# Altium schematic sheet Screen.SchDoc: =ProjectName
size A4; CheckedBy: DatNB; Author: Ven; CompanyName: Nacentech; Organization: IMET
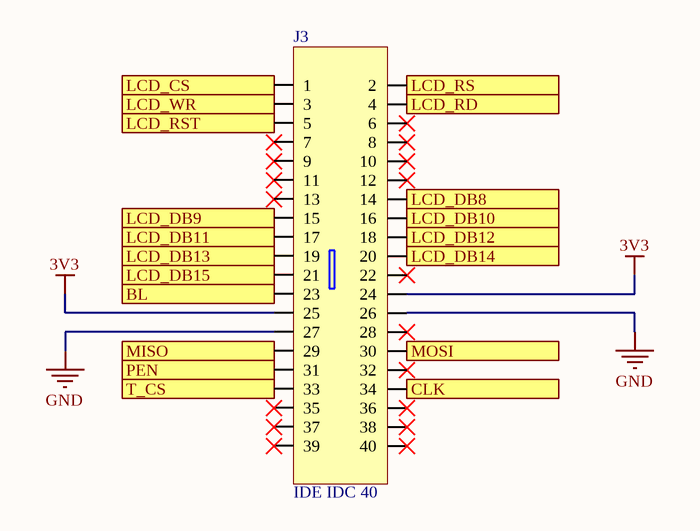
[diagram p0: Screen.SchDoc]

## Parts
J3  IDE IDC 40  [IDE 20X2]

## Ports
BL (in), CLK (in), LCD_CS (in), LCD_DB8 (in), LCD_DB9 (in), LCD_DB10 (in), LCD_DB11 (in), LCD_DB12 (in), LCD_DB13 (in), LCD_DB14 (in), LCD_DB15 (in), LCD_RD (in), LCD_RS (in), LCD_RST (in), LCD_WR (in), MISO (out), MOSI (in), PEN (out), T_CS (in)

## Nets
3V3: J3.24 J3.25
GND: J3.26 J3.27
BL: J3.23 ; port BL
CLK: J3.34 ; port CLK
LCD_CS: J3.1 ; port LCD_CS
LCD_DB8: J3.14 ; port LCD_DB8
LCD_DB9: J3.15 ; port LCD_DB9
LCD_DB10: J3.16 ; port LCD_DB10
LCD_DB11: J3.17 ; port LCD_DB11
LCD_DB12: J3.18 ; port LCD_DB12
LCD_DB13: J3.19 ; port LCD_DB13
LCD_DB14: J3.20 ; port LCD_DB14
LCD_DB15: J3.21 ; port LCD_DB15
LCD_RD: J3.4 ; port LCD_RD
LCD_RS: J3.2 ; port LCD_RS
LCD_RST: J3.5 ; port LCD_RST
LCD_WR: J3.3 ; port LCD_WR
MISO: J3.29 ; port MISO
MOSI: J3.30 ; port MOSI
PEN: J3.31 ; port PEN
T_CS: J3.33 ; port T_CS

Not connected (* = marked no-connect by the designer): J3 6* 7* 8* 9* 10* 11* 12* 13* 22* 28* 32* 35* 36* 37* 38* 39* 40*

## Notes on the sheet
- Project:
- Page Contents:
- Size:
- Date:
- A4
- Checked by:
- Time:
- Revision:
- Sheet
- of
- File:

## Library data of the parts
J3 = IDC 20X2